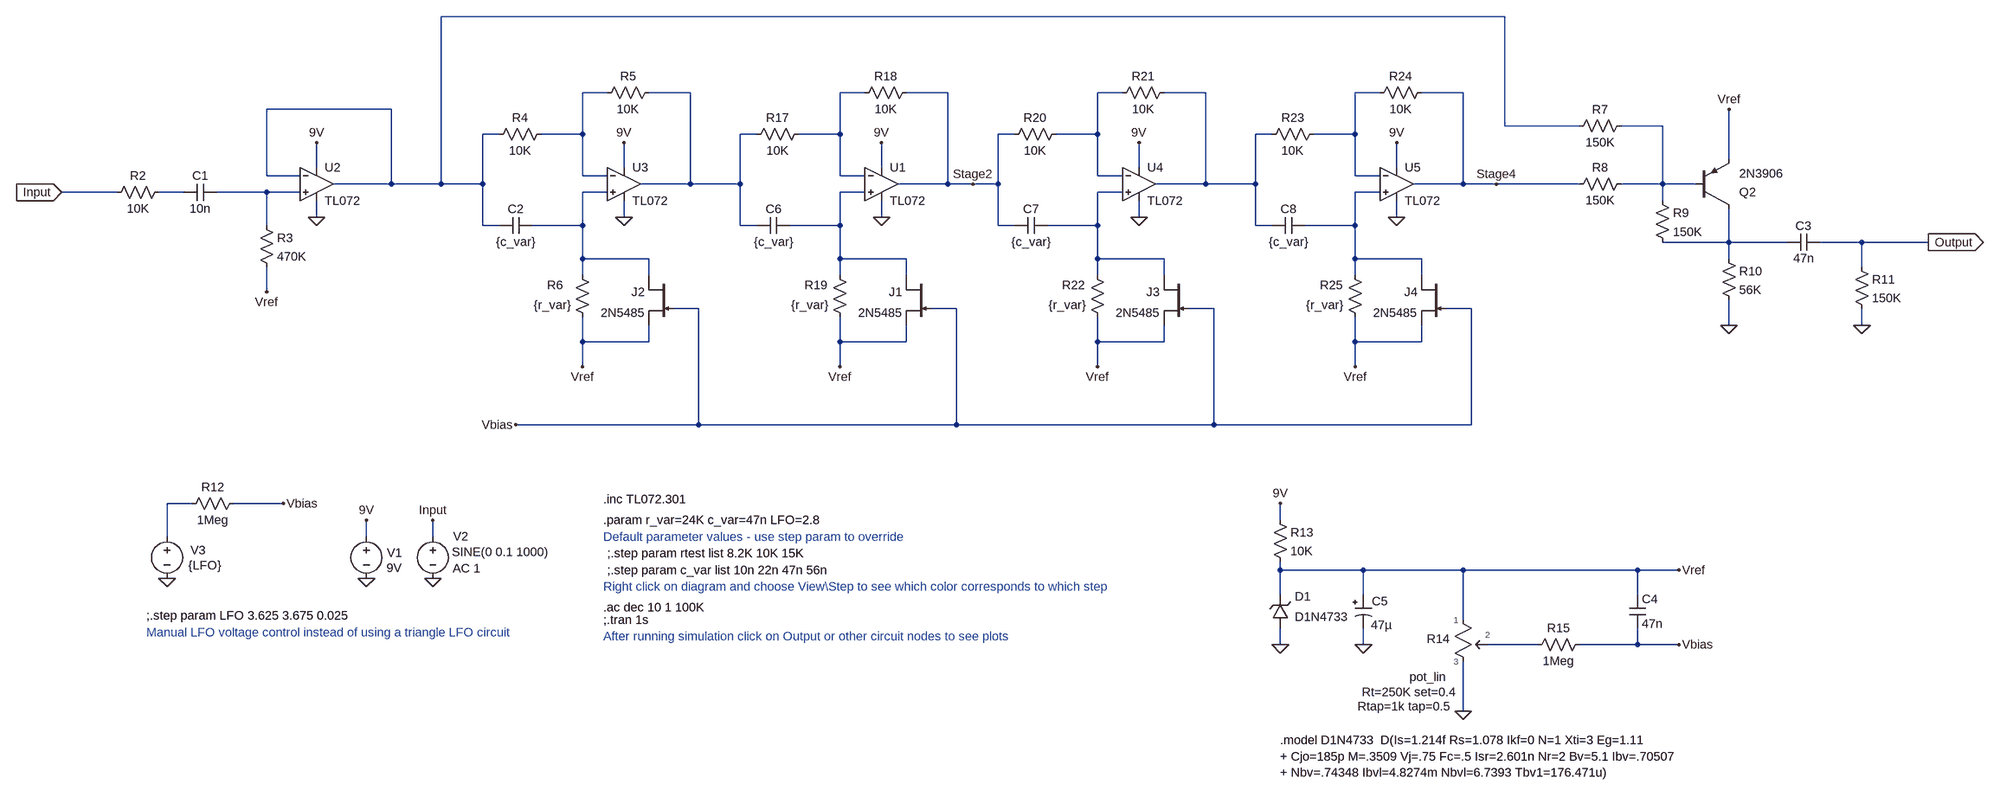
[diagram p0: schematic Phaser_Circuit_Test.asc]
Phaser_Circuit_Test.asc, the LTspice schematic file:
Version 4
SHEET 1 4292 1516
WIRE 448 -384 -1600 -384
WIRE -1280 -64 -1328 -64
WIRE -1120 -64 -1200 -64
WIRE -784 -64 -832 -64
WIRE -624 -64 -704 -64
WIRE -288 -64 -336 -64
WIRE -128 -64 -208 -64
WIRE 208 -64 160 -64
WIRE 368 -64 288 -64
WIRE -1696 -32 -1936 -32
WIRE 448 0 448 -384
WIRE 592 0 448 0
WIRE 752 0 672 0
WIRE -1488 16 -1520 16
WIRE -1328 16 -1328 -64
WIRE -1328 16 -1408 16
WIRE -992 16 -1024 16
WIRE -832 16 -832 -64
WIRE -832 16 -912 16
WIRE -496 16 -528 16
WIRE -336 16 -336 -64
WIRE -336 16 -416 16
WIRE 0 16 -32 16
WIRE 160 16 160 -64
WIRE 160 16 80 16
WIRE 880 64 880 -32
WIRE -1840 80 -1840 32
WIRE -1248 80 -1248 32
WIRE -752 80 -752 32
WIRE -256 80 -256 32
WIRE 240 80 240 32
WIRE -1936 96 -1936 -32
WIRE -1872 96 -1936 96
WIRE -1328 96 -1328 16
WIRE -1280 96 -1328 96
WIRE -832 96 -832 16
WIRE -784 96 -832 96
WIRE -336 96 -336 16
WIRE -288 96 -336 96
WIRE 160 96 160 16
WIRE 208 96 160 96
WIRE -1696 112 -1696 -32
WIRE -1696 112 -1808 112
WIRE -1600 112 -1600 -384
WIRE -1600 112 -1696 112
WIRE -1520 112 -1520 16
WIRE -1520 112 -1600 112
WIRE -1120 112 -1120 -64
WIRE -1120 112 -1216 112
WIRE -1024 112 -1024 16
WIRE -1024 112 -1120 112
WIRE -624 112 -624 -64
WIRE -624 112 -720 112
WIRE -576 112 -624 112
WIRE -528 112 -528 16
WIRE -528 112 -576 112
WIRE -128 112 -128 -64
WIRE -128 112 -224 112
WIRE -32 112 -32 16
WIRE -32 112 -128 112
WIRE 368 112 368 -64
WIRE 368 112 272 112
WIRE 432 112 368 112
WIRE 592 112 432 112
WIRE 752 112 752 0
WIRE 752 112 672 112
WIRE 816 112 752 112
WIRE -2224 128 -2384 128
WIRE -2096 128 -2144 128
WIRE -1936 128 -2032 128
WIRE -1872 128 -1936 128
WIRE -1280 128 -1328 128
WIRE -784 128 -832 128
WIRE -288 128 -336 128
WIRE 208 128 160 128
WIRE 752 144 752 112
WIRE -1840 176 -1840 144
WIRE -1248 176 -1248 144
WIRE -752 176 -752 144
WIRE -256 176 -256 144
WIRE 240 176 240 144
WIRE -1936 192 -1936 128
WIRE -1520 192 -1520 112
WIRE -1488 192 -1520 192
WIRE -1328 192 -1328 128
WIRE -1328 192 -1424 192
WIRE -1024 192 -1024 112
WIRE -992 192 -1024 192
WIRE -832 192 -832 128
WIRE -832 192 -928 192
WIRE -528 192 -528 112
WIRE -496 192 -528 192
WIRE -336 192 -336 128
WIRE -336 192 -432 192
WIRE -32 192 -32 112
WIRE 0 192 -32 192
WIRE 160 192 160 128
WIRE 160 192 64 192
WIRE 880 224 880 160
WIRE 880 224 752 224
WIRE 992 224 880 224
WIRE 1136 224 1056 224
WIRE 1264 224 1136 224
WIRE -1328 256 -1328 192
WIRE -1200 256 -1328 256
WIRE -832 256 -832 192
WIRE -704 256 -832 256
WIRE -336 256 -336 192
WIRE -208 256 -336 256
WIRE 160 256 160 192
WIRE 288 256 160 256
WIRE 880 256 880 224
WIRE 1136 272 1136 224
WIRE -1328 288 -1328 256
WIRE -1200 288 -1200 256
WIRE -832 288 -832 256
WIRE -704 288 -704 256
WIRE -336 288 -336 256
WIRE -208 288 -208 256
WIRE 160 288 160 256
WIRE 288 288 288 256
WIRE -1936 320 -1936 272
WIRE -1104 352 -1152 352
WIRE -608 352 -656 352
WIRE -112 352 -160 352
WIRE 384 352 336 352
WIRE 880 384 880 336
WIRE 1136 384 1136 352
WIRE -1328 416 -1328 368
WIRE -1200 416 -1200 384
WIRE -1200 416 -1328 416
WIRE -832 416 -832 368
WIRE -704 416 -704 384
WIRE -704 416 -832 416
WIRE -336 416 -336 368
WIRE -208 416 -208 384
WIRE -208 416 -336 416
WIRE 160 416 160 368
WIRE 288 416 288 384
WIRE 288 416 160 416
WIRE -1328 464 -1328 416
WIRE -832 464 -832 416
WIRE -336 464 -336 416
WIRE 160 464 160 416
WIRE -1104 576 -1104 352
WIRE -1104 576 -1456 576
WIRE -608 576 -608 352
WIRE -608 576 -1104 576
WIRE -112 576 -112 352
WIRE -112 576 -608 576
WIRE 384 576 384 352
WIRE 384 576 -112 576
WIRE -2080 736 -2128 736
WIRE -1904 736 -2000 736
WIRE 16 768 16 736
WIRE -2128 800 -2128 736
WIRE -1744 800 -1744 768
WIRE -1616 800 -1616 768
WIRE 16 864 16 848
WIRE 176 864 16 864
WIRE 368 864 176 864
WIRE 704 864 368 864
WIRE 784 864 704 864
WIRE 16 912 16 864
WIRE 176 912 176 864
WIRE 704 912 704 864
WIRE 368 960 368 864
WIRE 16 1008 16 976
WIRE 176 1008 176 976
WIRE 512 1008 416 1008
WIRE 704 1008 704 976
WIRE 704 1008 592 1008
WIRE 784 1008 704 1008
WIRE 368 1136 368 1040
FLAG -1744 880 0
FLAG -1744 768 9V
FLAG -1616 880 0
FLAG -1616 768 Input
FLAG 16 1008 0
FLAG 16 736 9V
FLAG 784 864 Vref
FLAG -1840 176 0
FLAG -1840 32 9V
FLAG -2384 128 Input
IOPIN -2384 128 In
FLAG 784 1008 Vbias
FLAG -1936 320 Vref
FLAG -1248 176 0
FLAG -1248 32 9V
FLAG -1328 464 Vref
FLAG 880 -32 Vref
FLAG 880 384 0
FLAG 1136 384 0
FLAG 1264 224 Output
IOPIN 1264 224 Out
FLAG -1456 576 Vbias
FLAG -2128 880 0
FLAG -1904 736 Vbias
FLAG 368 1136 0
FLAG -752 176 0
FLAG -752 32 9V
FLAG -832 464 Vref
FLAG -256 176 0
FLAG -256 32 9V
FLAG -336 464 Vref
FLAG 240 176 0
FLAG 240 32 9V
FLAG 160 464 Vref
FLAG 176 1008 0
FLAG 432 112 Stage4
FLAG -576 112 Stage2
SYMBOL voltage -1744 784 R0
WINDOW 123 0 0 Left 0
WINDOW 39 0 0 Left 0
WINDOW 0 40 47 Left 2
WINDOW 3 39 76 Left 2
SYMATTR InstName V1
SYMATTR Value 9V
SYMBOL voltage -1616 784 R0
WINDOW 123 38 77 Left 2
WINDOW 39 24 44 Left 2
WINDOW 3 37 45 Left 2
WINDOW 0 39 15 Left 2
SYMATTR Value2 AC 1
SYMATTR Value SINE(0 0.1 1000)
SYMATTR InstName V2
SYMBOL res 0 752 R0
WINDOW 0 36 40 Left 2
WINDOW 3 36 76 Left 2
SYMATTR InstName R13
SYMATTR Value 10K
SYMBOL polcap 160 912 R0
WINDOW 0 32 12 Left 2
WINDOW 3 31 58 Left 2
SYMATTR InstName C5
SYMATTR Value 47µ
SYMBOL opamp2 -1840 48 R0
WINDOW 0 16 32 Left 2
WINDOW 3 16 96 Left 2
SYMATTR InstName U2
SYMATTR Value TL072
SYMBOL res 608 992 R90
WINDOW 0 0 56 VBottom 2
WINDOW 3 32 56 VTop 2
SYMATTR InstName R15
SYMATTR Value 1Meg
SYMBOL cap 688 912 R0
SYMATTR InstName C4
SYMATTR Value 47n
SYMBOL cap -2032 112 R90
WINDOW 0 0 32 VBottom 2
WINDOW 3 32 32 VTop 2
SYMATTR InstName C1
SYMATTR Value 10n
SYMBOL res -2128 112 R90
WINDOW 0 0 56 VBottom 2
WINDOW 3 32 56 VTop 2
SYMATTR InstName R2
SYMATTR Value 10K
SYMBOL res -1952 176 R0
WINDOW 0 36 40 Left 2
WINDOW 3 36 76 Left 2
SYMATTR InstName R3
SYMATTR Value 470K
SYMBOL opamp2 -1248 48 R0
WINDOW 0 16 32 Left 2
WINDOW 3 16 96 Left 2
SYMATTR InstName U3
SYMATTR Value TL072
SYMBOL res -1392 0 R90
WINDOW 0 0 56 VBottom 2
WINDOW 3 32 56 VTop 2
SYMATTR InstName R4
SYMATTR Value 10K
SYMBOL res -1184 -80 R90
WINDOW 0 0 56 VBottom 2
WINDOW 3 32 56 VTop 2
SYMATTR InstName R5
SYMATTR Value 10K
SYMBOL cap -1424 176 R90
WINDOW 0 0 32 VBottom 2
WINDOW 3 32 32 VTop 2
SYMATTR InstName C2
SYMATTR Value {c_var}
SYMBOL res 688 96 R90
WINDOW 0 0 56 VBottom 2
WINDOW 3 32 56 VTop 2
SYMATTR InstName R8
SYMATTR Value 150K
SYMBOL res 688 -16 R90
WINDOW 0 0 56 VBottom 2
WINDOW 3 32 56 VTop 2
SYMATTR InstName R7
SYMATTR Value 150K
SYMBOL res -1344 272 R0
WINDOW 0 -52 35 Left 2
WINDOW 3 -78 73 Left 2
SYMATTR InstName R6
SYMATTR Value {r_var}
SYMBOL njf -1152 288 M0
WINDOW 0 56 32 Left 2
WINDOW 3 56 72 Left 2
SYMATTR InstName J2
SYMATTR Value 2N5485
SYMBOL pnp 816 160 M180
WINDOW 0 84 32 Left 2
WINDOW 3 84 68 Left 2
SYMATTR InstName Q2
SYMATTR Value 2N3906
SYMBOL res 736 128 R0
WINDOW 0 36 40 Left 2
WINDOW 3 36 76 Left 2
SYMATTR InstName R9
SYMATTR Value 150K
SYMBOL res 864 240 R0
WINDOW 0 36 40 Left 2
WINDOW 3 36 76 Left 2
SYMATTR InstName R10
SYMATTR Value 56K
SYMBOL cap 1056 208 R90
WINDOW 0 0 32 VBottom 2
WINDOW 3 32 32 VTop 2
SYMATTR InstName C3
SYMATTR Value 47n
SYMBOL res 1120 256 R0
WINDOW 0 36 40 Left 2
WINDOW 3 36 76 Left 2
SYMATTR InstName R11
SYMATTR Value 150K
SYMBOL res -1984 720 R90
WINDOW 0 0 56 VBottom 2
WINDOW 3 32 56 VTop 2
SYMATTR InstName R12
SYMATTR Value 1Meg
SYMBOL voltage -2128 784 R0
WINDOW 123 38 77 Left 2
WINDOW 39 24 44 Left 2
WINDOW 3 41 71 Left 2
WINDOW 0 45 42 Left 2
SYMATTR Value {LFO}
SYMATTR InstName V3
SYMBOL zener 32 976 R180
WINDOW 0 -43 61 Left 2
WINDOW 3 -114 22 Left 2
SYMATTR InstName D1
SYMATTR Value D1N4733
SYMBOL opamp2 -752 48 R0
WINDOW 0 16 32 Left 2
WINDOW 3 16 96 Left 2
SYMATTR InstName U1
SYMATTR Value TL072
SYMBOL res -896 0 R90
WINDOW 0 0 56 VBottom 2
WINDOW 3 32 56 VTop 2
SYMATTR InstName R17
SYMATTR Value 10K
SYMBOL res -688 -80 R90
WINDOW 0 0 56 VBottom 2
WINDOW 3 32 56 VTop 2
SYMATTR InstName R18
SYMATTR Value 10K
SYMBOL cap -928 176 R90
WINDOW 0 0 32 VBottom 2
WINDOW 3 32 32 VTop 2
SYMATTR InstName C6
SYMATTR Value {c_var}
SYMBOL res -848 272 R0
WINDOW 0 -52 35 Left 2
WINDOW 3 -78 73 Left 2
SYMATTR InstName R19
SYMATTR Value {r_var}
SYMBOL njf -656 288 M0
WINDOW 0 56 32 Left 2
WINDOW 3 56 72 Left 2
SYMATTR InstName J1
SYMATTR Value 2N5485
SYMBOL opamp2 -256 48 R0
WINDOW 0 16 32 Left 2
WINDOW 3 16 96 Left 2
SYMATTR InstName U4
SYMATTR Value TL072
SYMBOL res -400 0 R90
WINDOW 0 0 56 VBottom 2
WINDOW 3 32 56 VTop 2
SYMATTR InstName R20
SYMATTR Value 10K
SYMBOL res -192 -80 R90
WINDOW 0 0 56 VBottom 2
WINDOW 3 32 56 VTop 2
SYMATTR InstName R21
SYMATTR Value 10K
SYMBOL cap -432 176 R90
WINDOW 0 0 32 VBottom 2
WINDOW 3 32 32 VTop 2
SYMATTR InstName C7
SYMATTR Value {c_var}
SYMBOL res -352 272 R0
WINDOW 0 -52 35 Left 2
WINDOW 3 -78 73 Left 2
SYMATTR InstName R22
SYMATTR Value {r_var}
SYMBOL njf -160 288 M0
WINDOW 0 56 32 Left 2
WINDOW 3 56 72 Left 2
SYMATTR InstName J3
SYMATTR Value 2N5485
SYMBOL opamp2 240 48 R0
WINDOW 0 16 32 Left 2
WINDOW 3 16 96 Left 2
SYMATTR InstName U5
SYMATTR Value TL072
SYMBOL res 96 0 R90
WINDOW 0 0 56 VBottom 2
WINDOW 3 32 56 VTop 2
SYMATTR InstName R23
SYMATTR Value 10K
SYMBOL res 304 -80 R90
WINDOW 0 0 56 VBottom 2
WINDOW 3 32 56 VTop 2
SYMATTR InstName R24
SYMATTR Value 10K
SYMBOL cap 64 176 R90
WINDOW 0 0 32 VBottom 2
WINDOW 3 32 32 VTop 2
SYMATTR InstName C8
SYMATTR Value {c_var}
SYMBOL res 144 272 R0
WINDOW 0 -52 35 Left 2
WINDOW 3 -78 73 Left 2
SYMATTR InstName R25
SYMATTR Value {r_var}
SYMBOL njf 336 288 M0
WINDOW 0 56 32 Left 2
WINDOW 3 56 72 Left 2
SYMATTR InstName J4
SYMATTR Value 2N5485
SYMBOL pot 352 944 R0
WINDOW 0 -54 53 Left 2
WINDOW 3 -179 155 Left 2
WINDOW 39 -187 183 Left 2
WINDOW 38 -87 126 Left 2
SYMATTR InstName R14
SYMATTR Value Rt=250K set=0.4
TEXT -1288 728 Left 2 !.inc TL072.301
TEXT -1288 936 Left 2 !.ac dec 10 1 100K
TEXT -1288 960 Left 2 !;.tran 1s
TEXT -1288 768 Left 2 !.param r_var=24K c_var=47n LFO=2.8
TEXT -2168 952 Left 2 !;.step param LFO 3.625 3.675 0.025
TEXT -1280 832 Left 2 !;.step param rtest list 8.2K 10K 15K
TEXT -1280 864 Left 2 !;.step param c_var list 10n 22n 47n 56n
TEXT -2168 984 Left 2 ;Manual LFO voltage control instead of using a triangle LFO circuit
TEXT -1288 800 Left 2 ;Default parameter values - use step param to override
TEXT -1288 896 Left 2 ;Right click on diagram and choose View\\Step to see which color corresponds to which step
TEXT -1288 992 Left 2 ;After running simulation click on Output or other circuit nodes to see plots
TEXT 16 1192 Left 2 !.model D1N4733  D(Is=1.214f Rs=1.078 Ikf=0 N=1 Xti=3 Eg=1.11\n+ Cjo=185p M=.3509 Vj=.75 Fc=.5 Isr=2.601n Nr=2 Bv=5.1 Ibv=.70507\n+ Nbv=.74348 Ibvl=4.8274m Nbvl=6.7393 Tbv1=176.471u)

The netlist it stands for:
* Phaser_Circuit_Test.asc
V1 9V 0 9V
V2 Input 0 SINE(0 0.1 1000) AC 1
R13 9V Vref 10K
C5 Vref 0 47µ
XU2 N010 N001 9V 0 N001 TL072  ; pins In+ In- V+ V- OUT
R15 Vbias N017 1Meg
C4 Vref Vbias 47n
C1 N010 N009 10n
R2 N009 Input 10K
R3 N010 Vref 470K
XU3 N011 N002 9V 0 N003 TL072  ; pins In+ In- V+ V- OUT
R4 N002 N001 10K
R5 N003 N002 10K
C2 N011 N001 {c_var}
R8 N008 Stage4 150K
R7 N008 N001 150K
R6 N011 Vref {r_var}
J2 N011 Vbias Vref 2N5485
Q2 N015 N008 Vref 0 2N3906
R9 N008 N015 150K
R10 N015 0 56K
C3 Output N015 47n
R11 Output 0 150K
R12 Vbias N016 1Meg
V3 N016 0 {LFO}
D1 0 Vref D1N4733
XU1 N012 N004 9V 0 Stage2 TL072  ; pins In+ In- V+ V- OUT
R17 N004 N003 10K
R18 Stage2 N004 10K
C6 N012 N003 {c_var}
R19 N012 Vref {r_var}
J1 N012 Vbias Vref 2N5485
XU4 N013 N005 9V 0 N006 TL072  ; pins In+ In- V+ V- OUT
R20 N005 Stage2 10K
R21 N006 N005 10K
C7 N013 Stage2 {c_var}
R22 N013 Vref {r_var}
J3 N013 Vbias Vref 2N5485
XU5 N014 N007 9V 0 Stage4 TL072  ; pins In+ In- V+ V- OUT
R23 N007 N006 10K
R24 Stage4 N007 10K
C8 N014 N006 {c_var}
R25 N014 Vref {r_var}
J4 N014 Vbias Vref 2N5485
XR14 Vref N017 0 pot_lin Rt=250K set=0.4 Rtap=1k tap=0.5  ; pins 1 2 3
.model D D
.lib standard.dio
.model NPN NPN
.model PNP PNP
.lib standard.bjt
.model NJF NJF
.model PJF PJF
.lib standard.jft
.inc TL072.301
.ac dec 10 1 100K
;.tran 1s
.param r_var=24K c_var=47n LFO=2.8
;.step param LFO 3.625 3.675 0.025
;.step param rtest list 8.2K 10K 15K
;.step param c_var list 10n 22n 47n 56n
* Manual LFO voltage control instead of using a triangle LFO circuit
* Default parameter values - use step param to override
* Right click on diagram and choose View\Step to see which color corresponds to which step
* After running simulation click on Output or other circuit nodes to see plots
.model D1N4733  D(Is=1.214f Rs=1.078 Ikf=0 N=1 Xti=3 Eg=1.11
+ Cjo=185p M=.3509 Vj=.75 Fc=.5 Isr=2.601n Nr=2 Bv=5.1 Ibv=.70507
+ Nbv=.74348 Ibvl=4.8274m Nbvl=6.7393 Tbv1=176.471u)
.lib pot.lib
.backanno
.end